# Altium schematic sheet TI_ADC_CURRENT.SchDoc
size 999 x 999 mm
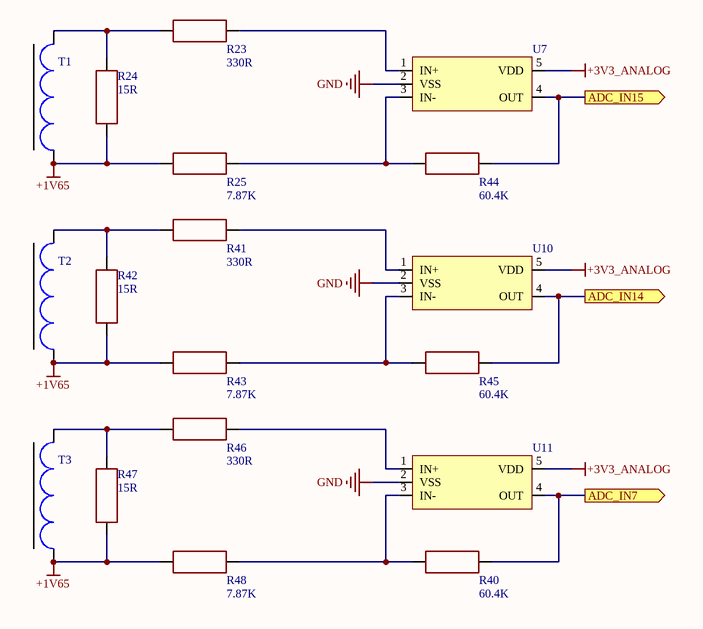
[diagram p0: TI_ADC_CURRENT.SchDoc]

## Parts
R23  value 330R  [RES: 0603]  (hidden comment: Resistor_0603)
R24  value 15R  [RES: 0603]  (hidden comment: Resistor_0603)
R25  value 7.87K  [RES: 0603]  (hidden comment: Resistor_0603)
R40  value 60.4K  [RES: 0603]  (hidden comment: Resistor_0603)
R41  value 330R  [RES: 0603]  (hidden comment: Resistor_0603)
R42  value 15R  [RES: 0603]  (hidden comment: Resistor_0603)
R43  value 7.87K  [RES: 0603]  (hidden comment: Resistor_0603)
R44  value 60.4K  [RES: 0603]  (hidden comment: Resistor_0603)
R45  value 60.4K  [RES: 0603]  (hidden comment: Resistor_0603)
R46  value 330R  [RES: 0603]  (hidden comment: Resistor_0603)
R47  value 15R  [RES: 0603]  (hidden comment: Resistor_0603)
R48  value 7.87K  [RES: 0603]  (hidden comment: Resistor_0603)
T1  AC-1005  [AC-1005]  (value not drawn)
T2  AC-1005  [AC-1005]  (value not drawn)
T3  AC-1005  [AC-1005]  (value not drawn)
U7  MCP6001U  [SOT-23-5]  (value not drawn)
U10  MCP6001U  [SOT-23-5]  (value not drawn)
U11  MCP6001U  [SOT-23-5]  (value not drawn)

## Ports
ADC_IN7 (out), ADC_IN14 (out), ADC_IN15 (out)

## Nets
+1V65: R24.1 R25.1 R42.2 R43.1 R47.1 R48.1 T1.1 T2.1 T3.1
+3V3_ANALOG: U7.5(VDD) U10.5(VDD) U11.5(VDD)
GND: U7.2(VSS) U10.2(VSS) U11.2(VSS)
ADC_IN7: R40.1 U11.4(OUT) ; port ADC_IN7
ADC_IN14: R45.1 U10.4(OUT) ; port ADC_IN14
ADC_IN15: R44.1 U7.4(OUT) ; port ADC_IN15
NetR23_1: R23.1 R24.2 T1.2
NetR23_2: R23.2 U7.1(IN+)
NetR25_2: R25.2 R44.2 U7.3(IN-)
NetR40_2: R40.2 R48.2 U11.3(IN-)
NetR41_1: R41.1 R42.1 T2.2
NetR41_2: R41.2 U10.1(IN+)
NetR43_2: R43.2 R45.2 U10.3(IN-)
NetR46_1: R46.1 R47.2 T3.2
NetR46_2: R46.2 U11.1(IN+)

## Library data of the parts
R23-R25 R40-R48 = Resistor_0603: Power: 0.1W; Tolerance: ±5%; Package/Case: 0603; Temperature: -55...+125°C; Product Category: Resistors
T1-T3 = AC-1005: Current Transformer, primary current: 5A; Manufacturer: Talema; Analogue: CST-1005(https://eu.mouser.com/datasheet/2/410/CST_1005-1892657.pdf); Datasheet: https://static.chipdip.ru/lib/884/DOC003884697.pdf; HelpURL: https://www.chipdip.ru/product/ac-1005; Product Category: Current Transformers
U7 U10 U11 = MCP6001U: 1 MHz, Low-Power Op Amp; Manufacturer: Microchip; Datasheet: https://eu.mouser.com/ProductDetail/Microchip-Technology-Atmel/MCP6004-I-SL?qs=n%2FfJlMG9rCZ2%2F%2FCryvZ52w%3D%3D; HelpURL: https://eu.mouser.com/ProductDetail/Microchip-Technology-Atmel/MCP6001UT-I-OT?qs=Sez7gRs8XSU2iw24kVuIOw%3D%3D; Package/Case: SOT-23-5; Product Category: Operational Amplifiers